# EAGLE schematic whistler (EAGLE 6.5.0)
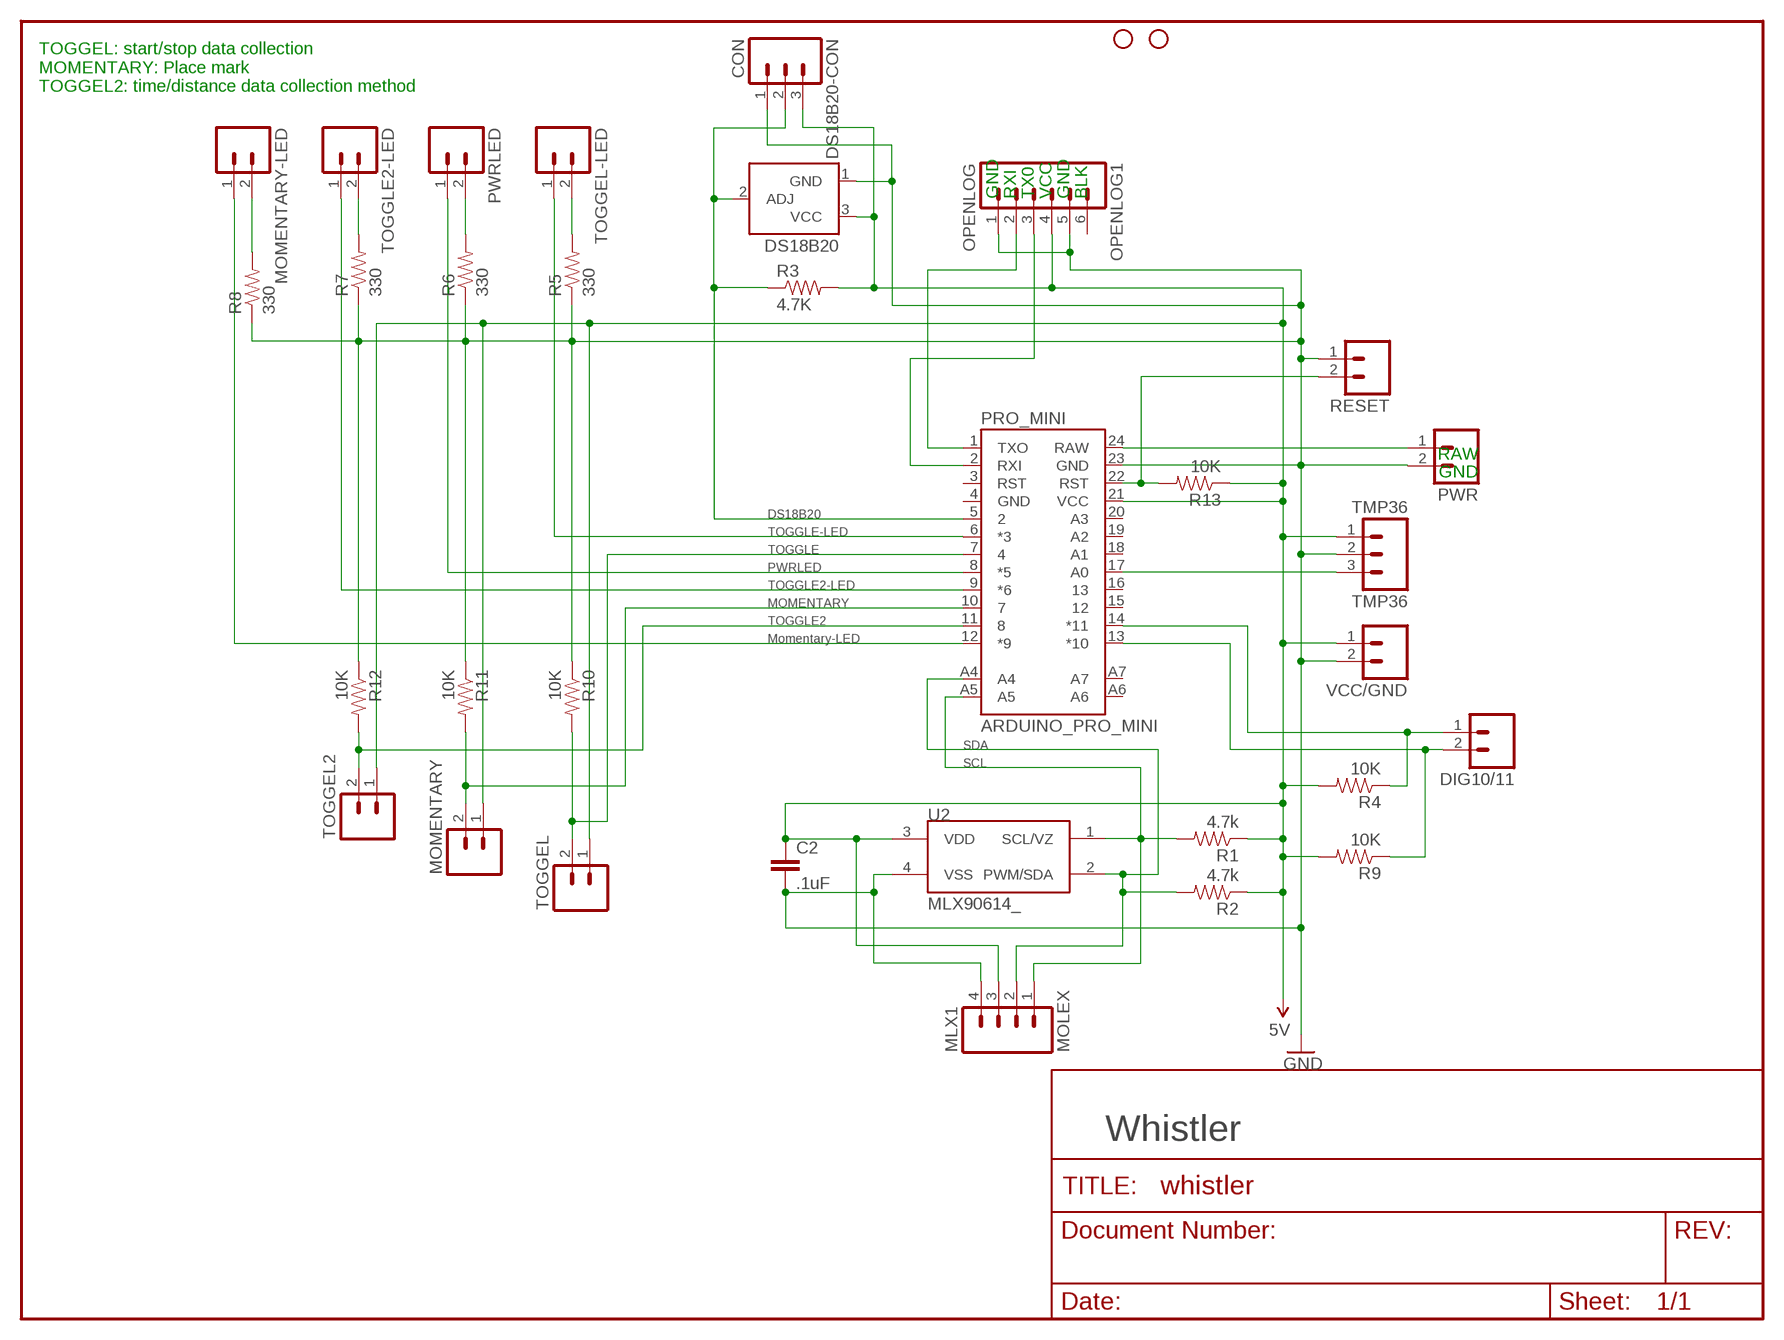
[diagram p0: schematic, sheet 1]

## Parts
C2  .1uF  0.1UF-50V-20%(PTH)KIT-EZ  [CAP-PTH-SMALL-KIT]
DIG10/11  M023.5MM_LOCK  [SCREWTERMINAL-3.5MM-2_LOCK]
DS18B20  TEMPERATURE-SENSOR  [TO-92]
DS18B20-CON  CON  M03SCREW_LOCK  [SCREWTERMINAL-3.5MM-3_LOCK.007S]
JP6  STAND-OFFTIGHT  [STAND-OFF-TIGHT]
JP7  STAND-OFFTIGHT  [STAND-OFF-TIGHT]
MLX1  MOLEX  M04SMD2  [1X04-1MM-RA]
MOMENTARY  M023.5MM_LOCK  [SCREWTERMINAL-3.5MM-2_LOCK]
MOMENTARY-LED  M023.5MM_LOCK  [SCREWTERMINAL-3.5MM-2_LOCK]
OPENLOG1  OPENLOG  M06LOCK  [1X06_LOCK]
PRO_MINI  ARDUINO_PRO_MINI  [ARDUINO_PRO_MINI]
PWR  M023.5MM_LOCK  [SCREWTERMINAL-3.5MM-2_LOCK]
PWRLED  M023.5MM_LOCK  [SCREWTERMINAL-3.5MM-2_LOCK]
R1  4.7k  RESISTORPTH-1/4W  [AXIAL-0.4]
R2  4.7k  RESISTORPTH-1/4W  [AXIAL-0.4]
R3  4.7K  RESISTORPTH-1/4W  [AXIAL-0.4]
R4  10K  10KOHM1/10W1%(0603)0603  [0603-RES]
R5  330  330OHM1/10W1%(0603)  [0603-RES]
R6  330  330OHM1/10W1%(0603)  [0603-RES]
R7  330  330OHM1/10W1%(0603)  [0603-RES]
R8  330  330OHM1/10W1%(0603)  [0603-RES]
R9  10K  10KOHM1/10W1%(0603)0603  [0603-RES]
R10  10K  10KOHM1/10W1%(0603)0603  [0603-RES]
R11  10K  10KOHM1/10W1%(0603)0603  [0603-RES]
R12  10K  10KOHM1/10W1%(0603)0603  [0603-RES]
R13  10K  10KOHM1/10W1%(0603)0603  [0603-RES]
RESET  M023.5MM_LOCK  [SCREWTERMINAL-3.5MM-2_LOCK]
TMP36  TMP36  M03SCREW_LOCK  [SCREWTERMINAL-3.5MM-3_LOCK.007S]
TOGGEL  M023.5MM_LOCK  [SCREWTERMINAL-3.5MM-2_LOCK]
TOGGEL2  M023.5MM_LOCK  [SCREWTERMINAL-3.5MM-2_LOCK]
TOGGEL-LED  M023.5MM_LOCK  [SCREWTERMINAL-3.5MM-2_LOCK]
TOGGLE2-LED  M023.5MM_LOCK  [SCREWTERMINAL-3.5MM-2_LOCK]
U2  MLX90614_  [TO-39]
VCC/GND  M023.5MM_LOCK  [SCREWTERMINAL-3.5MM-2_LOCK]

## Nets
5V [5V]: C2.1 DS18B20-CON.3 DS18B20.3(VCC) MLX1.3 MOMENTARY.1 OPENLOG1.4 PRO_MINI.21(VCC) R1.P$1 R2.P$1 R3.P$2 R4.2 R9.2 R13.1 TMP36.1 TOGGEL2.1 TOGGEL.1 U2.3(VDD) VCC/GND.1
GND [GND]: C2.2 DS18B20-CON.1 DS18B20.1(GND) MLX1.4 OPENLOG1.1 OPENLOG1.5 PRO_MINI.23(GND) PWR.2 R5.1 R6.1 R7.1 R8.1 R10.1 R11.1 R12.1 RESET.1 TMP36.2 U2.4(VSS) VCC/GND.2
N$1: PRO_MINI.7 R10.2 TOGGEL.2
N$2: DS18B20-CON.2 DS18B20.2(ADJ) PRO_MINI.5 R3.P$1
N$3: DIG10/11.1 PRO_MINI.14(*11) R4.1
N$4: PRO_MINI.24(RAW) PWR.1
N$5: R5.2 TOGGEL-LED.2
N$6: PRO_MINI.8(*5) PWRLED.1
N$7: OPENLOG1.3 PRO_MINI.2(RXI)
N$8: OPENLOG1.2 PRO_MINI.1(TXO)
N$10: MOMENTARY.2 PRO_MINI.10 R11.2
N$11: DIG10/11.2 PRO_MINI.13(*10) R9.1
N$12: PRO_MINI.6(*3) TOGGEL-LED.1
N$13: PRO_MINI.9(*6) TOGGLE2-LED.1
N$14: PWRLED.2 R6.2
N$15: R7.2 TOGGLE2-LED.2
N$16: MOMENTARY-LED.2 R8.2
N$17: MOMENTARY-LED.1 PRO_MINI.12(*9)
N$18: PRO_MINI.11 R12.2 TOGGEL2.2
N$19: PRO_MINI.22(RST) R13.2 RESET.2
N$20: PRO_MINI.17(A0) TMP36.3
N$21: MLX1.2 PRO_MINI.A4 R2.P$2 U2.2(PWM/SDA)
N$22: MLX1.1 PRO_MINI.A5 R1.P$2 U2.1(SCL/VZ)
Unconnected: OPENLOG1.6 PRO_MINI.3(RST) PRO_MINI.4(GND) PRO_MINI.15 PRO_MINI.16 PRO_MINI.18(A1) PRO_MINI.19(A2) PRO_MINI.20(A3) PRO_MINI.A6 PRO_MINI.A7

## Notes on the sheet
- TOGGEL: start/stop data collection
  MOMENTARY: Place mark
  TOGGEL2: time/distance data collection method
- GND | RXI | TX0 | VCC | GND | BLK
- RAW
- GND
- DS18B20
- TOGGLE-LED
- TOGGLE
- PWRLED
- TOGGLE2-LED
- MOMENTARY
- TOGGLE2
- Momentary-LED
- SDA
- SCL
- Whistler

## Library data of the parts
C2 = SparkFun-Capacitors:0.1UF-50V-20%(PTH): CAP-08370; PROD_ID: CAP-08370
DIG10/11 MOMENTARY MOMENTARY-LED PWR PWRLED RESET TOGGEL TOGGEL2 TOGGEL-LED TOGGLE2-LED VCC/GND = SparkFun-Connectors:M02: Standard 2-pin 0.1" header. Use with - straight break away headers ( PRT-00116) - right angle break away headers (PRT-00553) - swiss pins (PRT-00743) - machine pins (PRT-00117) - female headers (PRT-00115) Molex polarized connector foot print use with: PRT-08233 with associated crimp pins and housings. 2.54_SCREWTERM for use with PRT-10571. 3.5mm Screw Terminal footprints for PRT-08084 5mm Screw Terminal footprints for use with PRT-08433
DS18B20 = SparkFun-Sensors:TEMPERATURE-SENSOR: TO-92 temp sensor
DS18B20-CON TMP36 = SparkFun-Connectors:M03: Header 3 Standard 3-pin 0.1" header. Use with straight break away headers (SKU : PRT-00116), right angle break away headers (PRT-00553), swiss pins (PRT-00743), machine pins (PRT-00117), and female headers (PRT-00115). Molex polarized connector foot print use with SKU : PRT-08232 with associated crimp pins and housings.
JP6 JP7 = SparkFun:STAND-OFF: Stand Off This is the mechanical footprint for a #4 phillips button head screw. Use the keepout ring to avoid running the screw head into surrounding components. SKU : PRT-00447
MLX1 = SparkFun-Connectors:M04: Header 4 Standard 4-pin 0.1" header. Use with straight break away headers (SKU : PRT-00116), right angle break away headers (PRT-00553), swiss pins (PRT-00743), machine pins (PRT-00117), and female headers (PRT-00115). Molex polarized connector foot print use with SKU : PRT-08231 with associated crimp pins and housings. 1MM SMD Version SKU: PRT-10208
OPENLOG1 = SparkFun:M06: Header 6 Standard 6-pin 0.1" header. Use with straight break away headers (SKU : PRT-00116), right angle break away headers (PRT-00553), swiss pins (PRT-00743), machine pins (PRT-00117), and female headers (PRT-00115). Molex polarized connector foot print use with SKU : PRT-08094 with associated crimp pins and housings. NOTES ON THE VARIANTS LOCK and LOCK_LONGPADS... This footprint was designed to help hold the alignment of a through-hole component (i.e. 6-pin header) while soldering it into place. You may notice that each hole has been shifted either up or down by 0.005 of an inch from it's more standard position (which is a perfectly straight line). This slight alteration caused the pins (the squares in the middle) to touch the edges of the holes. Because they are alternating, it causes a "brace" to hold the component in place. 0.005 has proven to be the perfect amount of "off-center" position when using our standard breakaway headers. Although looks a little odd when you look at the bare footprint, once you have a header in there, the alteration is very hard to notice. Also, if you push a header all the way into place, it is covered up entirely on the bottom side. This idea of altering the position of holes to aid alignment will be further integrated into the Sparkfun Library for other footprints. It can help hold any component with 3 or more connection pins.
PRO_MINI = SparkFun-Boards:ARDUINO_PRO_MINI
R1-R3 = SparkFun:RESISTOR: Resistor Basic schematic elements and footprints for 0603, 1206, and PTH resistors.
R4 R9-R13 = SparkFun-Resistors:10KOHM1/10W1%(0603): RES-00824; PROD_ID: RES-00824
R5-R8 = SparkFun-Resistors:330OHM1/10W1%(0603): RES-00818; PROD_ID: RES-00818
U2 = SparkFun:MLX90614: Melexis IR Thermometer

## Net classes
1 5V: width 0.61 mm
2 GND: width 0.61 mm